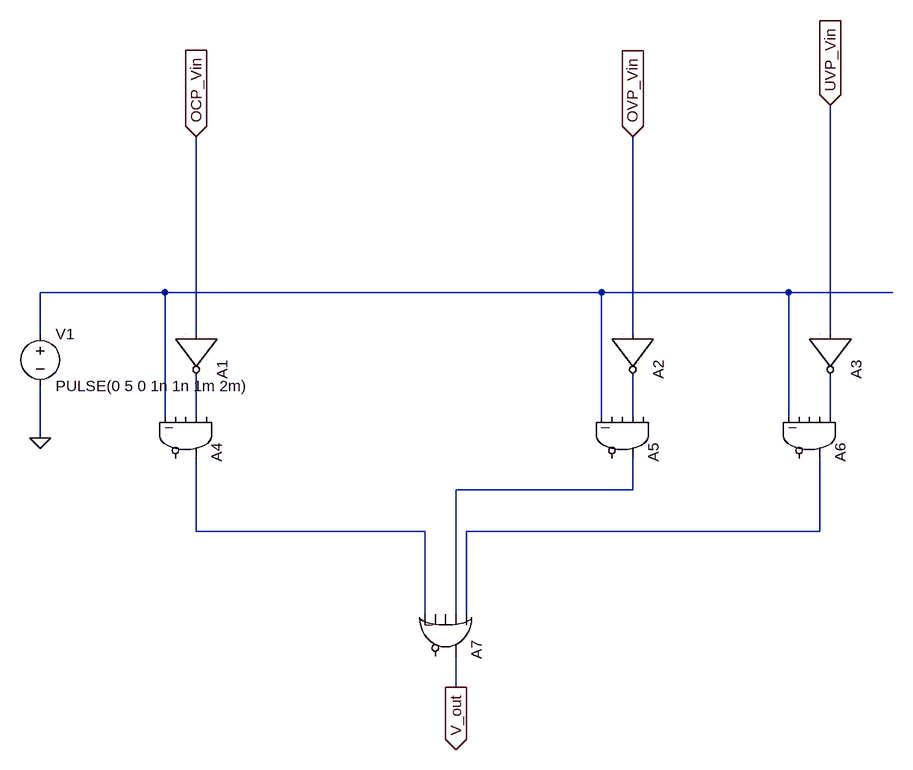
[diagram p0: schematic Control.asc]
Control.asc, the LTspice schematic file:
Version 4
SHEET 1 1172 1120
WIRE 16 160 -176 160
WIRE 688 160 16 160
WIRE 976 160 688 160
WIRE 1136 160 976 160
WIRE -176 224 -176 160
WIRE 64 224 64 -80
WIRE 736 224 736 -80
WIRE 1040 224 1040 -128
WIRE 16 352 16 160
WIRE 64 352 64 288
WIRE 688 352 688 160
WIRE 736 352 736 288
WIRE 976 352 976 160
WIRE 1040 352 1040 288
WIRE -176 384 -176 304
WIRE 736 464 736 416
WIRE 736 464 464 464
WIRE 64 528 64 416
WIRE 416 528 64 528
WIRE 1024 528 1024 416
WIRE 1024 528 480 528
WIRE 416 656 416 528
WIRE 464 656 464 464
WIRE 480 656 480 528
WIRE 464 768 464 720
FLAG -176 384 0
FLAG 64 -80 OCP_Vin
IOPIN 64 -80 In
FLAG 736 -80 OVP_Vin
IOPIN 736 -80 In
FLAG 1040 -128 UVP_Vin
IOPIN 1040 -128 In
FLAG 464 768 V_out
IOPIN 464 768 Out
SYMBOL Digital/inv 128 224 R90
SYMATTR InstName A1
SYMBOL Digital/inv 800 224 R90
SYMATTR InstName A2
SYMBOL Digital/inv 1104 224 R90
SYMATTR InstName A3
SYMBOL voltage -176 208 R0
SYMATTR InstName V1
SYMATTR Value PULSE(0 5 0 1n 1n 1m 2m)
SYMBOL Digital/and 112 384 R90
SYMATTR InstName A4
SYMBOL Digital/and 784 384 R90
SYMATTR InstName A5
SYMBOL Digital/and 1072 384 R90
SYMATTR InstName A6
SYMBOL Digital/or 512 688 R90
SYMATTR InstName A7

The netlist it stands for:
* Control.asc
A1 OCP_Vin 0 0 0 0 N002 0 0 BUF
A2 OVP_Vin 0 0 0 0 N003 0 0 BUF
A3 UVP_Vin 0 0 0 0 N004 0 0 BUF
V1 N001 0 PULSE(0 5 0 1n 1n 1m 2m)
A4 0 N002 0 0 N001 0 N006 0 AND
A5 0 N003 0 0 N001 0 N005 0 AND
A6 N004 0 0 0 N001 0 N007 0 AND
A7 N007 N005 0 0 N006 0 V_out 0 OR
.backanno
.end